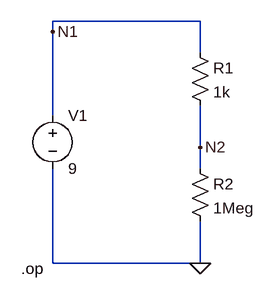
[diagram p0: schematic res.asc]
res.asc, the LTspice schematic file:
Version 4
SHEET 1 880 680
WIRE 304 -32 80 -32
WIRE 80 -16 80 -32
WIRE 304 16 304 -32
WIRE 80 112 80 -16
WIRE 304 160 304 96
WIRE 304 192 304 160
WIRE 80 336 80 192
WIRE 304 336 304 272
WIRE 304 336 80 336
FLAG 80 -16 N1
FLAG 304 160 N2
FLAG 304 336 0
SYMBOL voltage 80 96 R0
WINDOW 123 0 0 Left 0
WINDOW 39 0 0 Left 0
SYMATTR InstName V1
SYMATTR Value 9
SYMBOL res 288 0 R0
SYMATTR InstName R1
SYMATTR Value 1k
SYMBOL res 288 176 R0
SYMATTR InstName R2
SYMATTR Value 1Meg
TEXT 32 344 Left 2 !.op

The netlist it stands for:
* res.asc
V1 N1 0 9
R1 N1 N2 1k
R2 N2 0 1Meg
.op
.backanno
.end